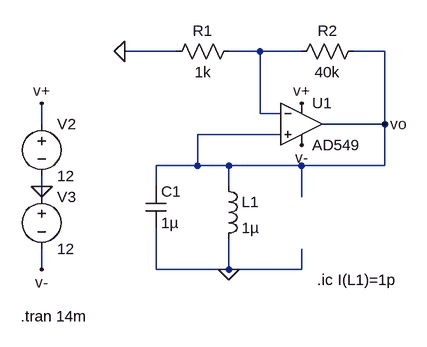
[diagram p0: schematic oscilador.asc]
oscilador.asc, the LTspice schematic file:
Version 4
SHEET 1 880 680
WIRE 96 -64 16 -64
WIRE 224 -64 176 -64
WIRE 288 -64 224 -64
WIRE 416 -64 368 -64
WIRE 224 32 224 -64
WIRE 256 32 224 32
WIRE -112 48 -112 16
WIRE 416 48 416 -64
WIRE 416 48 320 48
WIRE 256 64 128 64
WIRE 128 112 128 64
WIRE 128 112 64 112
WIRE 176 112 128 112
WIRE 288 112 176 112
WIRE 416 112 416 48
WIRE 416 112 288 112
WIRE -112 144 -112 128
WIRE 64 144 64 112
WIRE 176 144 176 112
WIRE -112 160 -112 144
WIRE 288 160 288 112
WIRE -112 272 -112 240
WIRE 64 272 64 208
WIRE 176 272 176 224
WIRE 176 272 64 272
WIRE 288 272 288 240
WIRE 288 272 176 272
FLAG -112 144 0
FLAG 16 -64 0
FLAG -112 16 v+
FLAG 288 16 v+
FLAG -112 272 v-
FLAG 288 80 v-
FLAG 416 48 vo
FLAG 176 272 0
SYMBOL cap 48 144 R0
SYMATTR InstName C1
SYMATTR Value 1µ
SYMBOL ind 160 128 R0
SYMATTR InstName L1
SYMATTR Value 1µ
SYMBOL OpAmps\\AD549 288 -16 R0
SYMATTR InstName U1
SYMBOL res 192 -80 R90
WINDOW 0 0 56 VBottom 2
WINDOW 3 32 56 VTop 2
SYMATTR InstName R1
SYMATTR Value 1k
SYMBOL res 384 -80 R90
WINDOW 0 0 56 VBottom 2
WINDOW 3 32 56 VTop 2
SYMATTR InstName R2
SYMATTR Value 40k
SYMBOL voltage -112 32 R0
WINDOW 123 0 0 Left 0
WINDOW 39 0 0 Left 0
SYMATTR InstName V2
SYMATTR Value 12
SYMBOL voltage -112 144 R0
WINDOW 123 0 0 Left 0
WINDOW 39 0 0 Left 0
SYMATTR InstName V3
SYMATTR Value 12
TEXT -144 344 Left 2 !.tran 14m
TEXT 312 288 Left 2 !.ic I(L1)=1p

The netlist it stands for:
* oscilador.asc
C1 vo 0 1µ
L1 vo 0 1µ
XU1 vo N001 v+ v- vo AD549  ; pins In+ In- V+ V- OUT
R1 N001 0 1k
R2 vo N001 40k
V2 v+ 0 12
V3 0 v- 12
.tran 14m
.ic I(L1)=1p
.backanno
.end